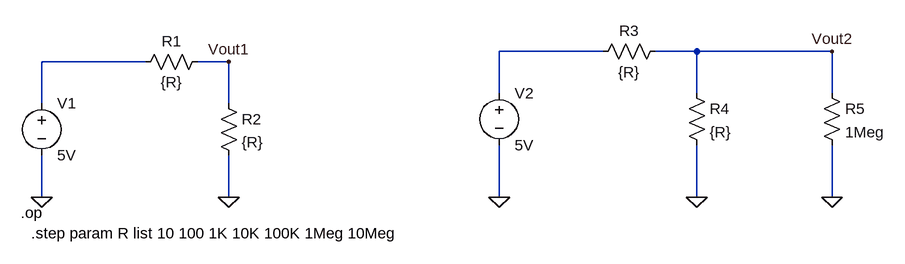
[diagram p0: schematic 3-3_Loading-affect.asc]
3-3_Loading-affect.asc, the LTspice schematic file:
Version 4.1
SHEET 1 984 680
WIRE 544 -176 384 -176
WIRE 688 -176 624 -176
WIRE 896 -176 688 -176
WIRE -160 -160 -320 -160
WIRE -32 -160 -80 -160
WIRE 384 -112 384 -176
WIRE 688 -112 688 -176
WIRE 896 -112 896 -176
WIRE -320 -96 -320 -160
WIRE -32 -96 -32 -160
WIRE -320 48 -320 -16
WIRE -32 48 -32 -16
WIRE 384 48 384 -32
WIRE 688 48 688 -32
WIRE 896 48 896 -32
FLAG -320 48 0
FLAG -32 48 0
FLAG 384 48 0
FLAG 688 48 0
FLAG 896 48 0
FLAG -32 -160 Vout1
FLAG 896 -176 Vout2
SYMBOL voltage -320 -112 R0
WINDOW 123 0 0 Left 0
WINDOW 39 0 0 Left 0
SYMATTR InstName V1
SYMATTR Value 5V
SYMBOL voltage 384 -128 R0
WINDOW 123 0 0 Left 0
WINDOW 39 0 0 Left 0
SYMATTR InstName V2
SYMATTR Value 5V
SYMBOL res -64 -176 R90
WINDOW 0 0 56 VBottom 2
WINDOW 3 32 56 VTop 2
SYMATTR InstName R1
SYMATTR Value {R}
SYMBOL res -48 -112 R0
SYMATTR InstName R2
SYMATTR Value {R}
SYMBOL res 640 -192 R90
WINDOW 0 0 56 VBottom 2
WINDOW 3 32 56 VTop 2
SYMATTR InstName R3
SYMATTR Value {R}
SYMBOL res 672 -128 R0
SYMATTR InstName R4
SYMATTR Value {R}
SYMBOL res 880 -128 R0
SYMATTR InstName R5
SYMATTR Value 1Meg
TEXT -352 72 Left 2 !.op
TEXT -336 104 Left 2 !.step param R list 10 100 1K 10K 100K 1Meg 10Meg

The netlist it stands for:
* 3-3_Loading-affect.asc
V1 N002 0 5V
V2 N001 0 5V
R1 Vout1 N002 {R}
R2 Vout1 0 {R}
R3 Vout2 N001 {R}
R4 Vout2 0 {R}
R5 Vout2 0 1Meg
.op
.step param R list 10 100 1K 10K 100K 1Meg 10Meg
.backanno
.end

* Results of the author's LTspice run, read from the files saved beside the schematic
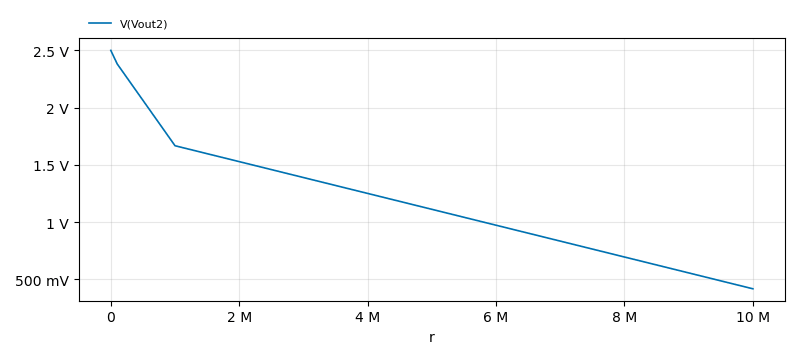
[diagram p1: Operating Point of 3-3_Loading-affect.asc, plotted from the saved traces]
* Operating Point, 1 run:
*   V(Vout2): 2.5 V at r=10 , 416.7 mV at r=10 M, min 416.7 mV, max 2.5 V